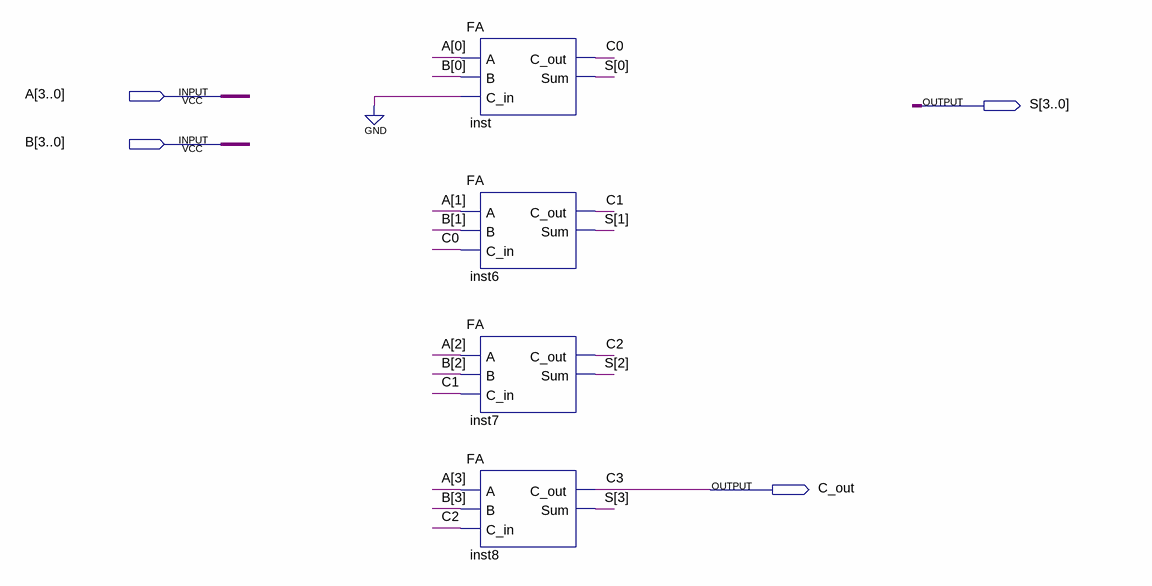
[diagram p0: schematic sheet]
// Quartus schematic 4BitAdder.bdf as structural Verilog: 4 symbols, 4 pins
module \4BitAdder  (
  input  [3:0] A,
  input  [3:0] B,
  output [3:0] S,
  output C_out
);

  wire C0, C1, C2;

  FA inst (.A(A[0]), .B(B[0]), .C_in(1'b0), .C_out(C0), .Sum(S[0]));
  FA inst6 (.A(A[1]), .B(B[1]), .C_in(C0), .C_out(C1), .Sum(S[1]));
  FA inst7 (.A(A[2]), .B(B[2]), .C_in(C1), .C_out(C2), .Sum(S[2]));
  FA inst8 (.A(A[3]), .B(B[3]), .C_in(C2), .C_out(C_out), .Sum(S[3]));

  // Other names for the same wires on the sheet: C3 = C_out
endmodule
